# Altium project Power.PrjPcb
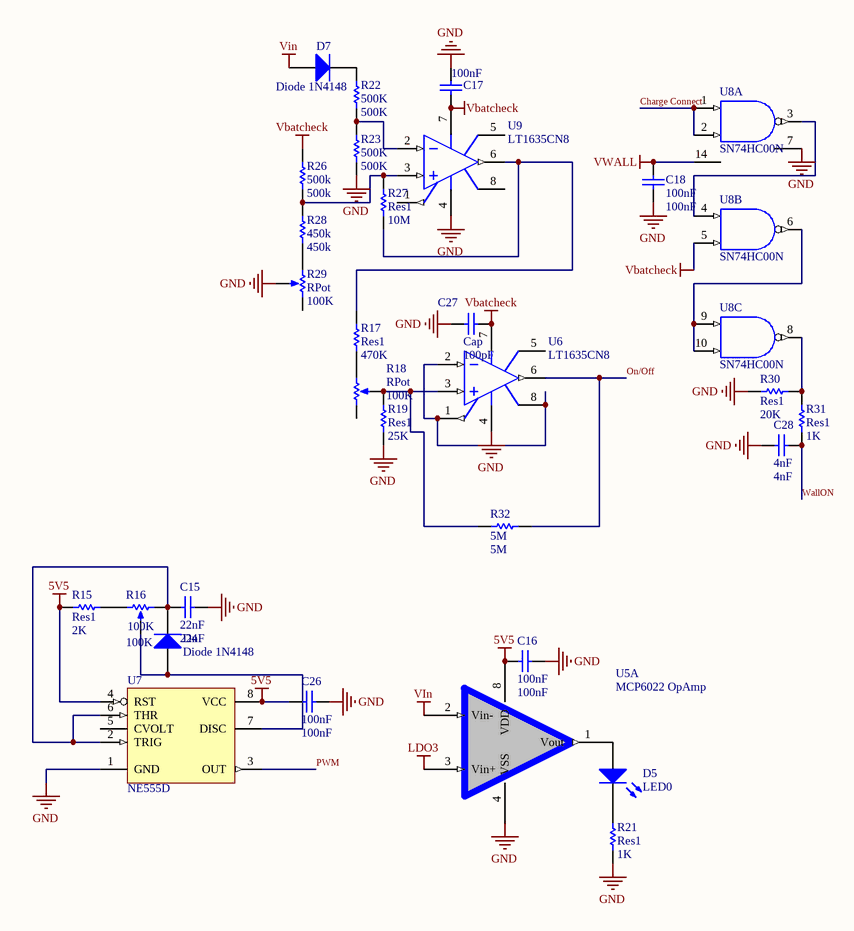
[diagram p0: Control_Sig.SchDoc]
2 sheets, 67 parts. Net scope: global (net labels, ports and power ports of the same name join across sheets).
Board file: Power.PcbDoc
Sheets:
  Control_Sig.SchDoc
  Power.SchDoc

## Sheet Control_Sig.SchDoc
size Letter

### Parts
C15  22nF  [C0805]
C16  100nF  [C0805]
C17  100nF  [C0805]
C18  100nF  [C0805]
C26  100nF  [C0805]
C27  Cap  value 100pF  [C0805]
C28  4nF  [C0805]
D4  Diode 1N4148  [Diode]
D5  LED0  [LED-0]
D7  Diode 1N4148  [Diode]
R15  Res1  value 2K  [6-0805_M]
R16  100K  [POT]
R17  Res1  value 470K  [6-0805_M]
R18  RPot  value 100K  [POT]
R19  Res1  value 25K  [6-0805_M]
R21  Res1  value 1K  [6-0805_M]
R22  500K  [6-0805_M]
R23  500K  [6-0805_M]
R26  500k  [6-0805_M]
R27  Res1  value 10M  [6-0805_M]
R28  450k  [6-0805_M]
R29  RPot  value 100K  [POT]
R30  Res1  value 20K  [6-0805_M]
R31  Res1  value 1K  [6-0805_M]
R32  5M  [6-0805_M]
U5  MCP6022 OpAmp  [SOP8_Opamp]  (part A of 2)
U6  LT1635CN8  [N8]
U7  NE555D  [D008_N]
U8  SN74HC00N  [N014]  (parts A,B,C of 4)
U9  LT1635CN8  [N8]

### Nets
5V5: C16.1 C26.1 R15.1 U5.8(VDD) U7.4(RST) U7.8(VCC)
GND: C15.2 C16.2 C17.2 C18.1 C26.2 C27.1 C28.1 R19.1 R21.1 R23.1 R29.2(TAP) R30.1 U5.4(VSS) U6.4(V-) U7.1(GND) U8.7(GND) U9.4(V-)
LDO3: U5.3(Vin+)
Vbatcheck: C17.1 C27.2 R26.2 U6.7(V+) U8.5(B) U9.7(V+)
VCC: U8.14(VCC)
VIn: D7.A U5.2(Vin-)
VWALL: C18.2 U8.14(VCC)
Charge Connect: U8.1(A) U8.2(B)
On/Off: R32.2 U6.6(OUT)
PWM: U7.3(OUT)
WallON: C28.2 R31.1
NetC15_1: C15.1 D4.K R16.3(BOT) U7.2(TRIG) U7.6(THR)
NetD4_A: D4.A R16.2(TAP) U7.7(DISC)
NetD5_1: D5.1(A) U5.1(Vout)
NetD5_2: D5.2(K) R21.2
NetD7_K: D7.K R22.2
NetR15_2: R15.2 R16.1(TOP)
NetR17_1: R17.1 R18.3(BOT)
NetR17_2: R17.2 R27.1 U9.6(OUT)
NetR18_2: R18.2(TAP) R19.2 R32.1 U6.3(IN+)
NetR22_1: R22.1 R23.2 U9.2(IN-)
NetR26_1: R26.1 R27.2 R28.2 U9.3(IN+)
NetR28_1: R28.1 R29.1(TOP)
NetR30_2: R30.2 R31.2 U8.8(Y)
NetU6_1: U6.1(REFOUT) U6.2(IN-) U6.8(REF_FBK)
NetU8_3: U8.3(Y) U8.4(A)
NetU8_6: U8.6(Y) U8.9(A) U8.10(B)

Not connected (* = marked no-connect by the designer): R18 1(TOP); R29 3(BOT); U6 5(BAL); U7 5(CVOLT); U9 1(REFOUT) 5(BAL) 8(REF_FBK)

### Library data of the parts
C15-C18 C26-C28 = Cap: Capacitor; Published: 8-Jun-2000; LatestRevisionDate: 17-Jul-2002; LatestRevisionNote: Re-released for DXP Platform.; PackageReference: RAD-0.3; Publisher: Altium Limited; PackageDescription: Radial Cap, Thru-Hole; 2 Leads; 0.3 in Pin Spacing
  C15: Value: 22nF
  C16-C18 C26: Value: 100nF
  C28: Value: 4nF
D4 D7 = Diode 1N4148: High Conductance Fast Diode; Published: 8-Jun-2000; LatestRevisionDate: 17-Jul-2002; LatestRevisionNote: Re-released for DXP Platform.; DatasheetVersion: 1997; PackageReference: DO-35; Publisher: Altium Limited; PackageDescription: Diode, Axial; Body 3.8 x 1.9 mm (LxDia. max), Lead Dia. 0.53 mm (max); Code_JEDEC: DO-204-AH; ComponentLink1Description: Manufacturer Link; ComponentLink1URL: http://www.fairchildsemi.com/; ComponentLink2Description: Datasheet; ComponentLink2URL: http://www.fairchildsemi.com/ds/1N%2F1N4148.pdf
D5 = LED0: Typical INFRARED GaAs LED; Published: 8-Jun-2000; LatestRevisionDate: 08-Jul-2005; LatestRevisionNote: Mech Layer 1 removed.; PackageReference: LED-0; Publisher: Altium Limited; PackageDescription: LED; 2 Leads
R15 = Res1: =value; Published: 8-Jun-2000; LatestRevisionDate: 17-Jul-2002; LatestRevisionNote: Re-released for DXP Platform.; PackageReference: AXIAL-0.3; Publisher: Altium Limited; PackageDescription: Axial Device, Thru-Hole; 2 Leads; 0.3 in Pin Spacing
R16 R18 R29 = RPot: Potentiometer; Sim Note: Enter the Resistance value and the set point into parameter fields.; Set Position: 0.5; Published: 8-Jun-2000; LatestRevisionDate: 17-Jul-2002; LatestRevisionNote: Re-released for DXP Platform.; PackageReference: VR5; Publisher: Altium Limited; PackageDescription: Variable Resistor, Thru-Hole; 3 Leads
  R16: Value: 100K
R17 R19 R21-R23 R26-R28 R30-R32 = Res1: Resistor; Published: 8-Jun-2000; LatestRevisionDate: 17-Jul-2002; LatestRevisionNote: Re-released for DXP Platform.; PackageReference: AXIAL-0.3; Publisher: Altium Limited; PackageDescription: Axial Device, Thru-Hole; 2 Leads; 0.3 in Pin Spacing
  R22 R23: Value: 500K
  R26: Value: 500k
  R28: Value: 450k
  R32: Value: 5M
U6 U9 = LT1635CN8: Micropower Rail-to-Rail Operational Amplifier and Reference; Note: 1479; Published: 8-Jun-2000; LatestRevisionDate: 29-May-2009; LatestRevisionNote: Component Body Added.; DatasheetVersion: 1996; PackageVersion: N8 1002; PackageReference: N8; Publisher: Altium Limited; PackageDescription: DIP, Plastic, 8-Pin, Row Spacing 7.62 mm, Pitch 2.54 mm; ComponentLink1Description: Manufacturer Link; ComponentLink1URL: http://www.linear.com/; ComponentLink2Description: Datasheet; ComponentLink2URL: http://www.linear.com/pc/downloadDocument.do?navId=H0,C1,C1154,C1002,C1243,P1586,D1992
U7 = NE555D: Precision Timer; Published: 16-Jan-2001; LatestRevisionDate: 13-Apr-2006; LatestRevisionNote: IPC-7351 Footprint Added.; DatasheetVersion: Feb-1992; PackageVersion: Jan-1998; PackageReference: D008; Publisher: Altium Limited; PackageDescription: 8-Pin Small Outline Integrated Circuit 1.27 mm Pitch; Code_IPC: SOIC127P600-8; ComponentLink1Description: Manufacturer Link; ComponentLink1URL: http://www.ti.com/; ComponentLink2Description: Datasheet; ComponentLink2URL: http://www-s.ti.com/sc/ds/ne555.pdf
U8 = SN74HC00N: Quadruple 2-Input Positive-NAND Gate; Published: 8-Jun-2000; LatestRevisionDate: 04-Mar-2005; LatestRevisionNote: Stylized 3D Model Added.; DatasheetVersion: May-1997; PackageVersion: Oct-1995; PackageReference: N014; Publisher: Altium Limited; PackageDescription: DIP; 14 Leads; Row Spacing 7.62 mm; Pitch 2.54 mm; ComponentLink1Description: Manufacturer Link; ComponentLink1URL: http://www.ti.com/; ComponentLink2Description: Datasheet; ComponentLink2URL: http://www-s.ti.com/sc/ds/sn74hc00.pdf

## Sheet Power.SchDoc
size Letter
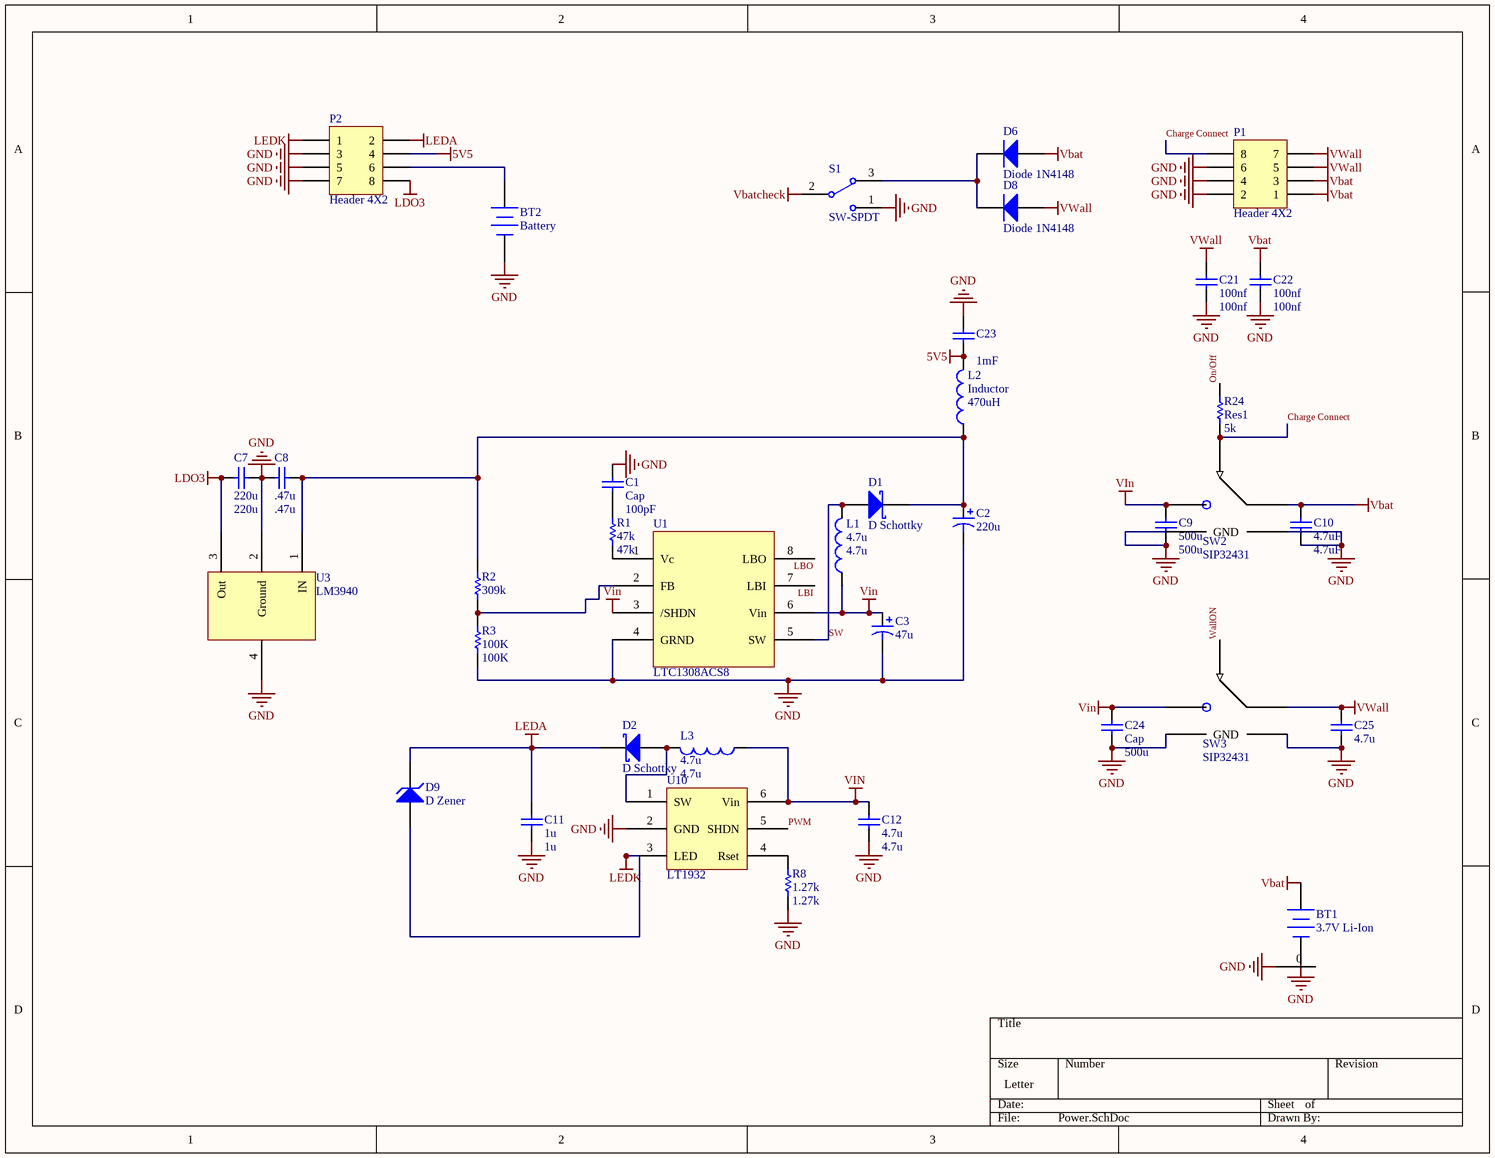
[diagram p1: Power.SchDoc]

### Parts
BT1  3.7V Li-Ion  [Batery Connector]
BT2  Battery  [10mm Coin Cell]
C1  Cap  value 100pF  [C0805]
C2  220u  [C2917]
C3  47u  [C2312]
C7  220u  [C2917]
C8  .47u  [C0805]
C9  500u  [C2917]
C10  4.7uF  [C0805]
C11  1u  [C1206]
C12  4.7u  [C0805]
C21  100nf  [C0805]
C22  100nf  [C0805]
C23  1mF  [C2917]
C24  Cap  value 500u  [C2917]
C25  4.7u  [C0805]
D1  D Schottky  [ShottkeyDiode]
D2  D Schottky  [ZHCSDiode]
D6  Diode 1N4148  [Diode]
D8  Diode 1N4148  [Diode]
D9  D Zener  [Zener]
L1  4.7u  [Inductor]
L2  Inductor  value 470uH  [470U inductor]
L3  4.7u  [Inductor]
P1  Header 4X2  [Molex MiniFit Jr8]
P2  Header 4X2  [Molex MiniFit Jr8]
R1  47k  [6-0805_M]
R2  309k  [6-0805_M]
R3  100K  [6-0805_M]
R8  1.27k  [6-0805_M]
R24  Res1  value 5k  [6-0805_M]
S1  SW-SPDT  [HDR1X3]
SW2  SIP32431  [SOT6 - duplicate]
SW3  SIP32431  [SOT6 - duplicate]
U1  LTC1308ACS8  [SOP8_LTC1308A]
U3  LM3940  [LDO]
U10  LT1932  [SOT6]

### Nets
5V5: C23.1 L2.2 P2.4
GND: BT1.0 BT1.2(-) BT2.2(-) C1.1 C2.2 C3.2 C7.2 C8.1 C9.1 C10.1 C11.1 C12.1 C21.1 C22.1 C23.2 C24.1 C25.1 P1.2 P1.4 P1.6 P2.3 P2.5 P2.7 R3.2 R8.1 S1.1 SW2.2(GND) SW2.5(GND) SW3.2(GND) SW3.5(GND) U1.4(GRND) U3.2(Ground) U3.4(Ground) U10.2(GND)
LDO3: C7.1 P2.8 U3.3(Out)
LEDA: C11.2 D2.2(K) D9.2(K) P2.2
LEDK: D9.1(A) P2.1 U10.3(LED)
Vbat: BT1.1(+) C10.2 C22.2 D6.A P1.1 P1.3 SW2.4(In)
Vbatcheck: S1.2
VIn: C3.1 C9.2 C12.2 C24.2 L1.1 L3.1 SW2.1(Out) SW3.1(Out) U1.3(/SHDN) U1.6(Vin) U10.6(Vin)
VWALL: C21.2 C25.2 D8.A P1.5 P1.7 SW3.4(In)
Charge Connect: P1.8 R24.1 SW2.3
LBI: U1.7(LBI)
LBO: U1.8(LBO)
On/Off: R24.2
PWM: U10.5(SHDN)
SW: D1.A L1.2 U1.5(SW)
WallON: SW3.3
NetBT2_1: BT2.1(+) P2.6
NetC1_2: C1.2 R1.2
NetC2_1: C2.1 C8.2 D1.K L2.1 R2.1 U3.1(IN)
NetD2_1: D2.1(A) L3.2 U10.1(SW)
NetD6_K: D6.K D8.K S1.3
NetR1_1: R1.1 U1.1(Vc)
NetR2_2: R2.2 R3.1 U1.2(FB)
NetR8_2: R8.2 U10.4(Rset)

### Library data of the parts
BT1 BT2 = Battery: Multicell Battery; Published: 24-Mar-1999; LatestRevisionDate: 17-Jul-2002; LatestRevisionNote: Re-released for DXP Platform.; PackageReference: BAT-2; Publisher: Altium Limited; PackageDescription: Battery; 2 Leads
C1 C7-C12 C21-C25 = Cap: Capacitor; Published: 8-Jun-2000; LatestRevisionDate: 17-Jul-2002; LatestRevisionNote: Re-released for DXP Platform.; PackageReference: RAD-0.3; Publisher: Altium Limited; PackageDescription: Radial Cap, Thru-Hole; 2 Leads; 0.3 in Pin Spacing
  C7: Value: 220u
  C8: Value: .47u
  C9: Value: 500u
  C10: Value: 4.7uF
  C11: Value: 1u
  C12 C25: Value: 4.7u
  C21 C22: Value: 100nf
  C23: Value: 1mF
C2 C3 = Cap Pol1: Polarized Capacitor (Radial); Published: 8-Jun-2000; LatestRevisionDate: 17-Jul-2002; LatestRevisionNote: Re-released for DXP Platform.; PackageReference: RB7.6-15; Publisher: Altium Limited; PackageDescription: Polarized Capacitor (Radial); 2 Leads
  C2: Value: 220u
  C3: Value: 47u
D1 = D Schottky: Schottky Diode; Published: 8-Jun-2000; LatestRevisionDate: 17-Jul-2002; LatestRevisionNote: Re-released for DXP Platform.; PackageReference: SMB; Publisher: Altium Limited; PackageDescription: DO-214-AA/SMB; 2 C-Bend Leads; Body 5.3 x 3.6 mm, inc. leads (LxW); Code_JEDEC: DO-214-AA
D2 = D Schottky: Schottky Diode; pin to pad: 1>A 2>K; Published: 8-Jun-2000; LatestRevisionDate: 17-Jul-2002; LatestRevisionNote: Re-released for DXP Platform.; PackageReference: SMB; Publisher: Altium Limited; PackageDescription: DO-214-AA/SMB; 2 C-Bend Leads; Body 5.3 x 3.6 mm, inc. leads (LxW); Code_JEDEC: DO-214-AA
D6 D8 = Diode 1N4148: High Conductance Fast Diode; Published: 8-Jun-2000; LatestRevisionDate: 17-Jul-2002; LatestRevisionNote: Re-released for DXP Platform.; DatasheetVersion: 1997; PackageReference: DO-35; Publisher: Altium Limited; PackageDescription: Diode, Axial; Body 3.8 x 1.9 mm (LxDia. max), Lead Dia. 0.53 mm (max); Code_JEDEC: DO-204-AH; ComponentLink1Description: Manufacturer Link; ComponentLink1URL: http://www.fairchildsemi.com/; ComponentLink2Description: Datasheet; ComponentLink2URL: http://www.fairchildsemi.com/ds/1N%2F1N4148.pdf
D9 = D Zener: Zener Diode; Published: 8-Jun-2000; LatestRevisionDate: 17-Jul-2002; LatestRevisionNote: Re-released for DXP Platform.; PackageReference: DIODE-0.7; Publisher: Altium Limited; PackageDescription: Diode, Thru-Hole; 2 Leads; 0.7 in Pin Spacing
L1-L3 = Inductor: Code_IEC: 1005; Published: 8-Jun-2000; LatestRevisionDate: 29-May-2009; LatestRevisionNote: IPC-7351 Footprint Added.; PackageReference: 0402-A; Publisher: Altium Limited; PackageDescription: Chip Inductor; Code_JEITA: 0402
  L1 L3: Value: 4.7u
P1 P2 = Header 4X2: Header, 4-Pin, Dual row; LatestRevisionDate: 17-Jul-2002; LatestRevisionNote: Re-released for DXP Platform.; Publisher: Altium Limited
R1-R3 R8 R24 = Res1: Resistor; Published: 8-Jun-2000; LatestRevisionDate: 17-Jul-2002; LatestRevisionNote: Re-released for DXP Platform.; PackageReference: AXIAL-0.3; Publisher: Altium Limited; PackageDescription: Axial Device, Thru-Hole; 2 Leads; 0.3 in Pin Spacing
  R1: Value: 47k
  R2: Value: 309k
  R3: Value: 100K
  R8: Value: 1.27k
S1 = SW-SPDT: SPDT Subminiature Toggle Switch, Right Angle Mounting, Vertical Actuation; Published: 24-Mar-1999; LatestRevisionDate: 17-Dec-2003; LatestRevisionNote: Schematic revised, PCB Footprint replaced.; DatasheetVersion: 05-Dec-2000; PackageReference: TL36WW15050; Publisher: Altium Limited; PackageDescription: Switch; 4 Leads; ComponentLink1Description: Manufacturer Link; ComponentLink1URL: http://www.apem.com

## Nets that join several sheets
5V5: Control_Sig (6 pins), Power (C23.1 L2.2 P2.4)
GND: Control_Sig (17 pins), Power (34 pins)
LDO3: Control_Sig (U5.3), Power (C7.1 P2.8 U3.3)
Vbatcheck: Control_Sig (6 pins), Power (S1.2)
VIn: Control_Sig (D7.A U5.2), Power (11 pins)
VWALL: Control_Sig (C18.2 U8.14), Power (6 pins)
Charge Connect: Control_Sig (U8.1 U8.2), Power (P1.8 R24.1 SW2.3)
On/Off: Control_Sig (R32.2 U6.6), Power (R24.2)
PWM: Control_Sig (U7.3), Power (U10.5)
WallON: Control_Sig (C28.2 R31.1), Power (SW3.3)